# EAGLE design laser_driver_V2 (EAGLE 5.06)
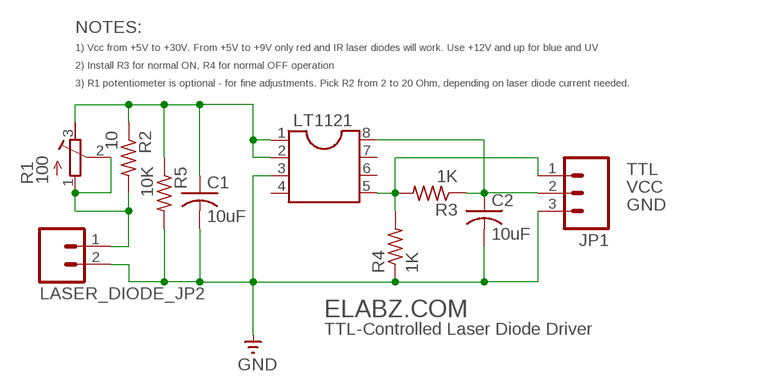
[diagram p0: schematic, sheet 1]

## Parts
C1  10uF  C-US025-025X050  [C025-025X050]
C2  10uF  C-US025-025X050  [C025-025X050]
JP1  M03PTH  [1X03]
LASER_DIODE_JP2  M02PTH  [1X02]
LT1121  DIL8  [DIL08]
R1  100  R-TRIMM3296W  [RTRIM3296W]
R2  10  R-US_0617/17  [0617/17]
R3  1K  R-US_0207/10  [0207/10]
R4  1K  R-US_0207/10  [0207/10]
R5  10K  R-US_0207/10  [0207/10]

## Nets
GND: C1.2 C2.2 JP1.3 LASER_DIODE_JP2.2 LT1121.3 R4.1 R5.2
N$2: LASER_DIODE_JP2.1 R1.1(E) R1.2(S) R2.2
N$6: C1.1 LT1121.1 LT1121.2 R1.3(A) R2.1 R5.1
N$7: C2.1 JP1.2 LT1121.8 R3.1
TTL: JP1.1 LT1121.5 R3.2 R4.2
Unconnected: LT1121.4 LT1121.6 LT1121.7

## Notes on the sheet
- NOTES:
- 1) Vcc from +5V to +30V. From +5V to +9V only red and IR laser diodes will work. Use +12V and up for blue and UV
- 2) Install R3 for normal ON, R4 for normal OFF operation
- 3) R1 potentiometer is optional - for fine adjustments. Pick R2 from 2 to 20 Ohm, depending on laser diode current needed.
- VCC
- GND
- ELABZ.COM
- TTL-Controlled Laser Diode Driver

## Library data of the parts
C1 C2 = rcl:C-US: CAPACITOR, American symbol
JP1 = SparkFun:M03: Header 3 Standard 3-pin 0.1" header. Use with straight break away headers (SKU : PRT-00116), right angle break away headers (PRT-00553), swiss pins (PRT-00743), machine pins (PRT-00117), and female headers (PRT-00115). Molex polarized connector foot print use with SKU : PRT-08232 with associated crimp pins and housings.
LASER_DIODE_JP2 = SparkFun:M02: Header 2 Standard 2-pin 0.1" header. Use with straight break away headers (SKU : PRT-00116), right angle break away headers (PRT-00553), swiss pins (PRT-00743), machine pins (PRT-00117), and female headers (PRT-00115). Molex polarized connector foot print use with SKU : PRT-08233 with associated crimp pins and housings.
LT1121 = ic-package:DIL8: Dual In Line / Socket
R1 = resistor:R-TRIMM: Trimm resistor
R2-R5 = resistor:R-US_: RESISTOR, American symbol

## Board
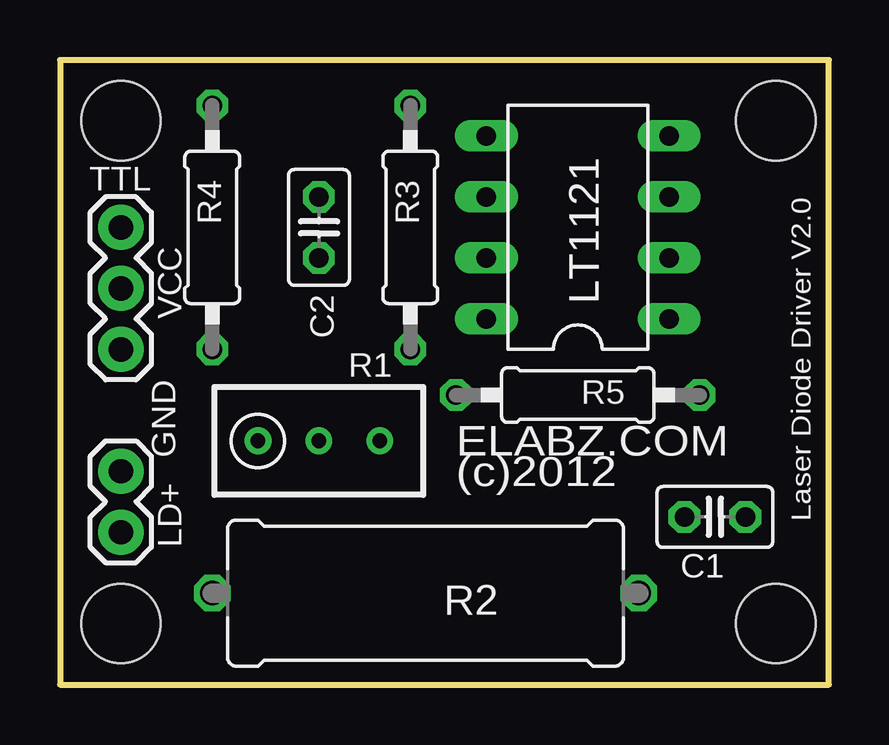
[diagram p1: board, top side]
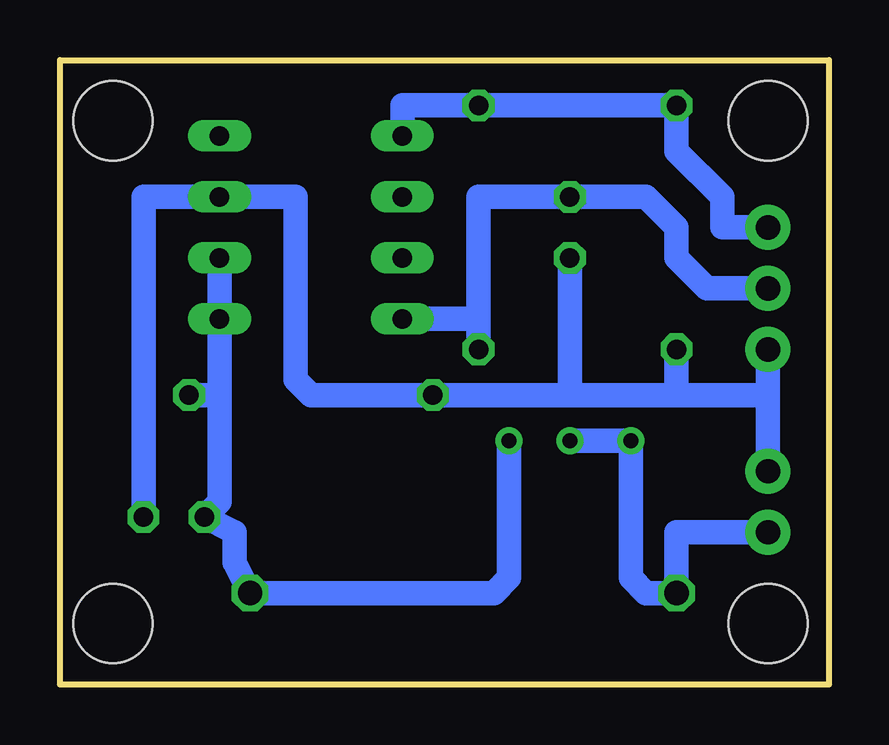
[diagram p2: board, bottom side, seen from below]

Size 32.05 x 26.02 mm. Coordinates in mm from the lower left corner, seen from the top.
Outline: 0,0 32.05,0 32.05,26.02 0,26.02 0,0
Copper layers (1*16): Top 0.035mm / dielectric 1.5mm / Bottom 0.035mm
Design rules "olimex-10mil-dru": minimum track width 10mil, minimum drill 24mil, track to track 10mil, track to pad 10mil, pad to pad 10mil, via to via 10mil, smd to smd 10mil, copper to edge 40mil, drill to drill 10mil, minimum pad ring 10mil, minimum via ring 8mil, stop-mask expansion 0mil, vias tented up to drill 0mil, thermal gap 10mil
Holes 3.3 mm at 2.54,2.54 2.54,23.5 29.84,23.5 29.84,2.54

### Footprints (pad centres in the part's own frame; a part is rotated, then mirrored left to right if it is on the bottom)
C025-025X050 = drill 0.813 octagon: 1 -1.27,0; 2 1.27,0
1X03 = drill 1.016 pad 1.88 round: 1 0,0; 2 2.54,0; 3 5.08,0
1X02 = drill 1.016 pad 1.88 round: 1 0,0; 2 2.54,0
DIL08 = drill 0.813 long: 1 -3.81,-3.81; 2 -1.27,-3.81; 3 1.27,-3.81; 4 3.81,-3.81; 5 3.81,3.81; 6 1.27,3.81; 7 -1.27,3.81; 8 -3.81,3.81
RTRIM3296W = drill 0.61 round: 1 0,-2.54; 2 0,0; 3 0,2.54
0617/17 = drill 1.016 octagon: 1 -8.89,0; 2 8.89,0
0207/10 = drill 0.813 octagon: 1 -5.08,0; 2 5.08,0

### Placement (x,y rotation side)
C1  27.3,6.99 0 top
C2  10.79,19.05 270 top
JP1  2.54,19.05 270 top
LASER_DIODE_JP2  2.54,6.35 90 top
LT1121  21.59,19.05 90 top
R1  10.79,10.16 270 top
R2  15.24,3.81 180 top
R3  14.61,19.05 90 top
R4  6.35,19.05 90 top
R5  21.59,12.06 180 top

### Tracks (layer width: path | path; a pad name or v marks a point on that pad's centre or on a via)
GND
  Bottom 0.406: R5.2 10.79,12.06
  Bottom 1.016: 10.79,12.06 C2.2 | 2.54,12.06 6.35,12.06 | 6.35,12.06 R5.2 21.59,12.06 22.23,12.7 22.23,20.32 LT1121.3 28.57,20.32 C1.2 | 2.54,12.06 JP1.3 | 6.35,12.06 R4.1 | LASER_DIODE_JP2.2 2.54,12.06
N$2
  Bottom 1.016: LASER_DIODE_JP2.1 6.35,6.35 R2.2 7.62,3.81 8.26,4.45 R1.1 R1.2
N$6
  Bottom 1.016: LT1121.2 LT1121.1 25.4,12.06 | R1.3 13.34,4.45 13.97,3.81 R2.1 24.77,5.08 24.77,6.35 C1.1 25.4,7.62 25.4,12.06 | R5.1 25.4,12.06
N$7
  Bottom 1.016: JP1.2 5.08,16.51 6.35,17.78 6.35,19.05 7.62,20.32 C2.1 14.61,20.32 14.61,15.24 | R3.1 14.61,15.24 | 14.61,15.24 LT1121.8
TTL
  Bottom 1.016: LT1121.5 17.78,24.13 R3.2 R4.2 6.35,22.23 4.45,20.32 4.45,19.05 JP1.1

### Text on the board
tNames: TTL | Laser Diode Driver V2.0 | VCC | GND | ELABZ.COM | (c)2012 | LD+